# Altium schematic sheet Matrix.SchDoc
size C; SheetNumber: 2; SheetTotal: 2
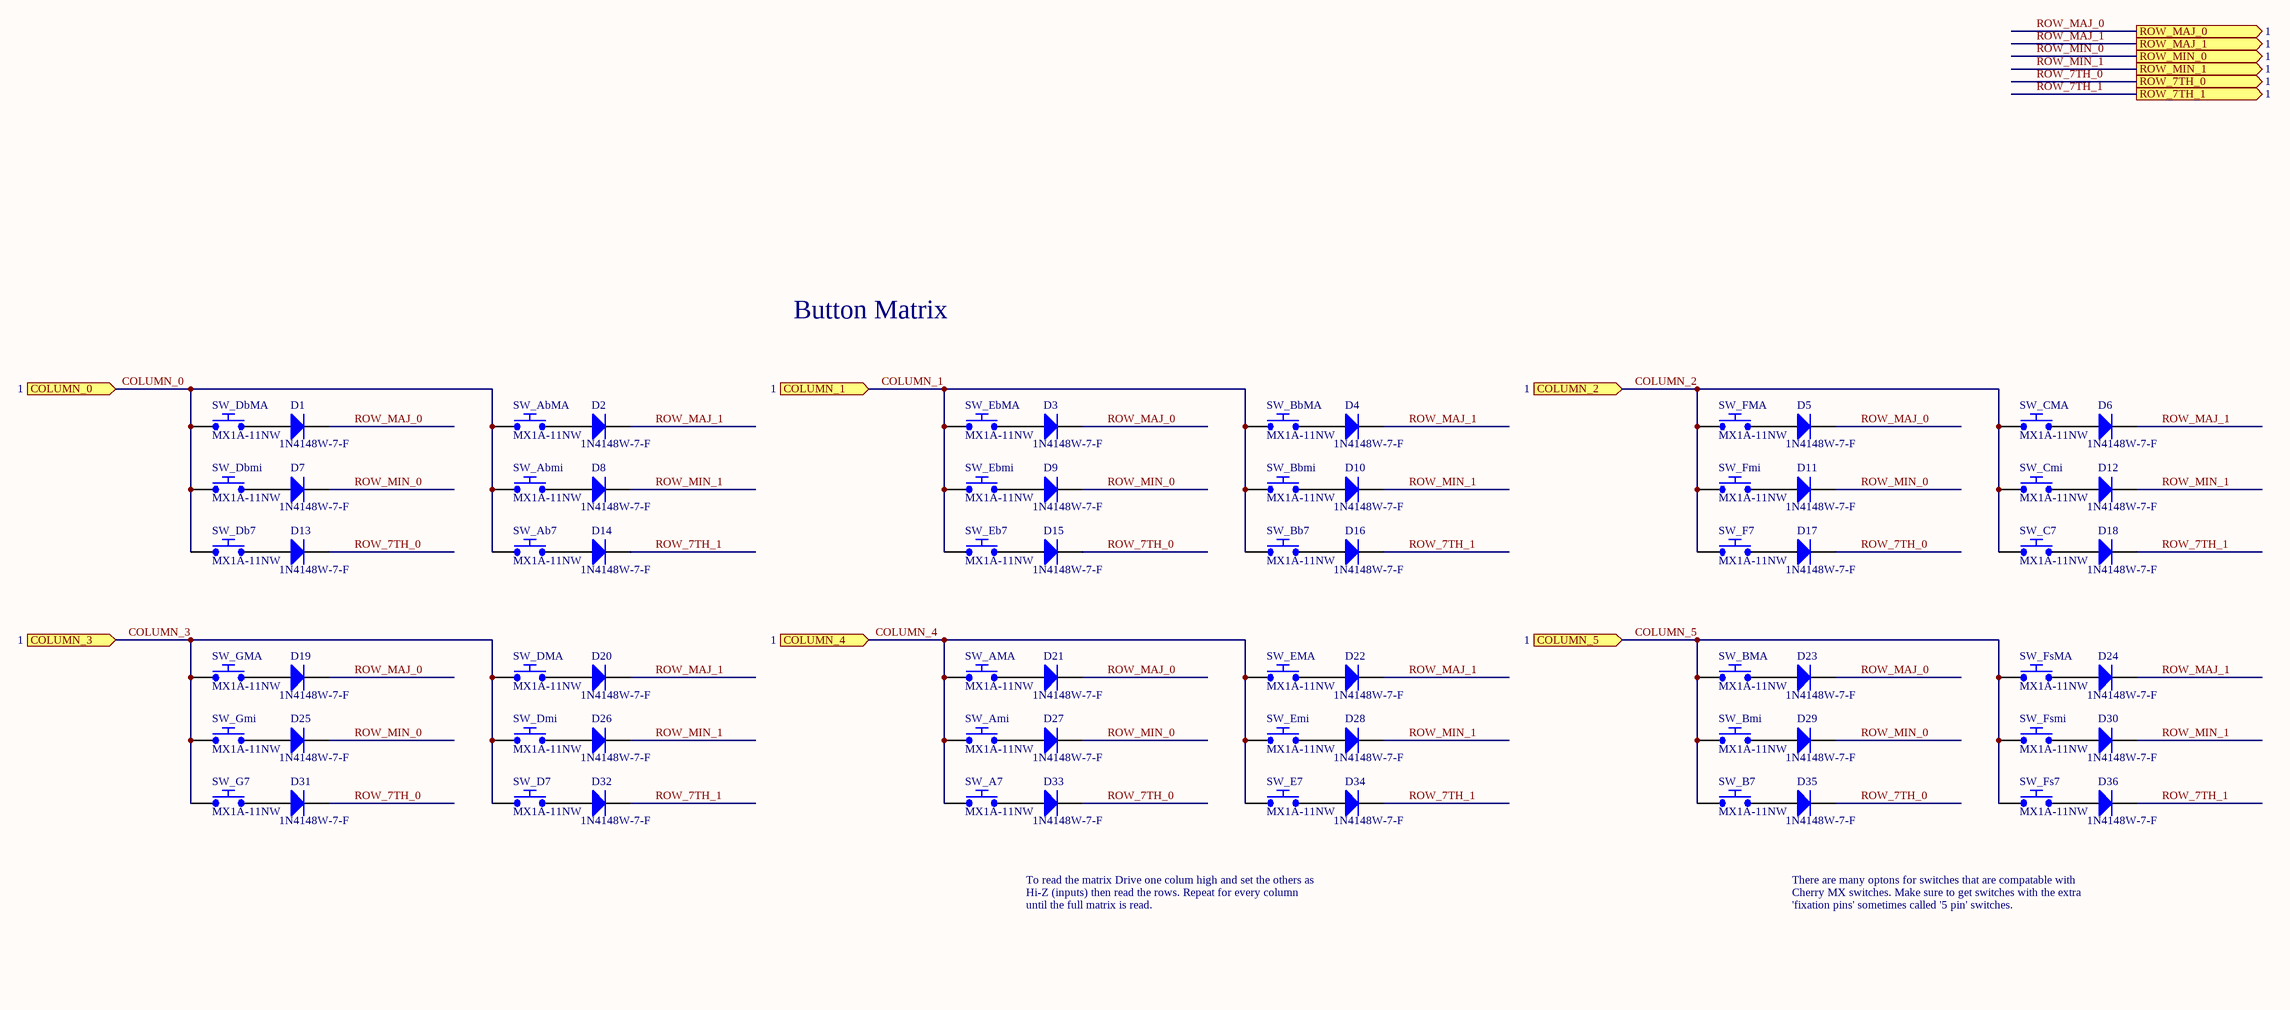
[diagram p0: Matrix.SchDoc]

## Parts
D1  1N4148W-7-F  [SOD-123]
D2  1N4148W-7-F  [SOD-123]
D3  1N4148W-7-F  [SOD-123]
D4  1N4148W-7-F  [SOD-123]
D5  1N4148W-7-F  [SOD-123]
D6  1N4148W-7-F  [SOD-123]
D7  1N4148W-7-F  [SOD-123]
D8  1N4148W-7-F  [SOD-123]
D9  1N4148W-7-F  [SOD-123]
D10  1N4148W-7-F  [SOD-123]
D11  1N4148W-7-F  [SOD-123]
D12  1N4148W-7-F  [SOD-123]
D13  1N4148W-7-F  [SOD-123]
D14  1N4148W-7-F  [SOD-123]
D15  1N4148W-7-F  [SOD-123]
D16  1N4148W-7-F  [SOD-123]
D17  1N4148W-7-F  [SOD-123]
D18  1N4148W-7-F  [SOD-123]
D19  1N4148W-7-F  [SOD-123]
D20  1N4148W-7-F  [SOD-123]
D21  1N4148W-7-F  [SOD-123]
D22  1N4148W-7-F  [SOD-123]
D23  1N4148W-7-F  [SOD-123]
D24  1N4148W-7-F  [SOD-123]
D25  1N4148W-7-F  [SOD-123]
D26  1N4148W-7-F  [SOD-123]
D27  1N4148W-7-F  [SOD-123]
D28  1N4148W-7-F  [SOD-123]
D29  1N4148W-7-F  [SOD-123]
D30  1N4148W-7-F  [SOD-123]
D31  1N4148W-7-F  [SOD-123]
D32  1N4148W-7-F  [SOD-123]
D33  1N4148W-7-F  [SOD-123]
D34  1N4148W-7-F  [SOD-123]
D35  1N4148W-7-F  [SOD-123]
D36  1N4148W-7-F  [SOD-123]
SW_A7  MX1A-11NW  [CHERRY_MX_FIX]
SW_Ab7  MX1A-11NW  [CHERRY_MX_FIX]
SW_AbMA  MX1A-11NW  [CHERRY_MX_FIX]
SW_Abmi  MX1A-11NW  [CHERRY_MX_FIX]
SW_AMA  MX1A-11NW  [CHERRY_MX_FIX]
SW_Ami  MX1A-11NW  [CHERRY_MX_FIX]
SW_B7  MX1A-11NW  [CHERRY_MX_FIX]
SW_Bb7  MX1A-11NW  [CHERRY_MX_FIX]
SW_BbMA  MX1A-11NW  [CHERRY_MX_FIX]
SW_Bbmi  MX1A-11NW  [CHERRY_MX_FIX]
SW_BMA  MX1A-11NW  [CHERRY_MX_FIX]
SW_Bmi  MX1A-11NW  [CHERRY_MX_FIX]
SW_C7  MX1A-11NW  [CHERRY_MX_FIX]
SW_CMA  MX1A-11NW  [CHERRY_MX_FIX]
SW_Cmi  MX1A-11NW  [CHERRY_MX_FIX]
SW_D7  MX1A-11NW  [CHERRY_MX_FIX]
SW_Db7  MX1A-11NW  [CHERRY_MX_FIX]
SW_DbMA  MX1A-11NW  [CHERRY_MX_FIX]
SW_Dbmi  MX1A-11NW  [CHERRY_MX_FIX]
SW_DMA  MX1A-11NW  [CHERRY_MX_FIX]
SW_Dmi  MX1A-11NW  [CHERRY_MX_FIX]
SW_E7  MX1A-11NW  [CHERRY_MX_FIX]
SW_Eb7  MX1A-11NW  [CHERRY_MX_FIX]
SW_EbMA  MX1A-11NW  [CHERRY_MX_FIX]
SW_Ebmi  MX1A-11NW  [CHERRY_MX_FIX]
SW_EMA  MX1A-11NW  [CHERRY_MX_FIX]
SW_Emi  MX1A-11NW  [CHERRY_MX_FIX]
SW_F7  MX1A-11NW  [CHERRY_MX_FIX]
SW_FMA  MX1A-11NW  [CHERRY_MX_FIX]
SW_Fmi  MX1A-11NW  [CHERRY_MX_FIX]
SW_Fs7  MX1A-11NW  [CHERRY_MX_FIX]
SW_FsMA  MX1A-11NW  [CHERRY_MX_FIX]
SW_Fsmi  MX1A-11NW  [CHERRY_MX_FIX]
SW_G7  MX1A-11NW  [CHERRY_MX_FIX]
SW_GMA  MX1A-11NW  [CHERRY_MX_FIX]
SW_Gmi  MX1A-11NW  [CHERRY_MX_FIX]

## Ports
COLUMN_0 (in, see 1), COLUMN_1 (in, see 1), COLUMN_2 (in, see 1), COLUMN_3 (in, see 1), COLUMN_4 (in, see 1), COLUMN_5 (in, see 1), ROW_7TH_0 (out, see 1), ROW_7TH_1 (out, see 1), ROW_MAJ_0 (out, see 1), ROW_MAJ_1 (out, see 1), ROW_MIN_0 (out, see 1), ROW_MIN_1 (out, see 1)

## Nets
COLUMN_0: SW_Ab7.1 SW_AbMA.1 SW_Abmi.1 SW_Db7.1 SW_DbMA.1 SW_Dbmi.1 ; port COLUMN_0
COLUMN_1: SW_Bb7.1 SW_BbMA.1 SW_Bbmi.1 SW_Eb7.1 SW_EbMA.1 SW_Ebmi.1 ; port COLUMN_1
COLUMN_2: SW_C7.1 SW_CMA.1 SW_Cmi.1 SW_F7.1 SW_FMA.1 SW_Fmi.1 ; port COLUMN_2
COLUMN_3: SW_D7.1 SW_DMA.1 SW_Dmi.1 SW_G7.1 SW_GMA.1 SW_Gmi.1 ; port COLUMN_3
COLUMN_4: SW_A7.1 SW_AMA.1 SW_Ami.1 SW_E7.1 SW_EMA.1 SW_Emi.1 ; port COLUMN_4
COLUMN_5: SW_B7.1 SW_BMA.1 SW_Bmi.1 SW_Fs7.1 SW_FsMA.1 SW_Fsmi.1 ; port COLUMN_5
ROW_7TH_0: D13.1(C) D15.1(C) D17.1(C) D31.1(C) D33.1(C) D35.1(C) ; port ROW_7TH_0
ROW_7TH_1: D14.1(C) D16.1(C) D18.1(C) D32.1(C) D34.1(C) D36.1(C) ; port ROW_7TH_1
ROW_MAJ_0: D1.1(C) D3.1(C) D5.1(C) D19.1(C) D21.1(C) D23.1(C) ; port ROW_MAJ_0
ROW_MAJ_1: D2.1(C) D4.1(C) D6.1(C) D20.1(C) D22.1(C) D24.1(C) ; port ROW_MAJ_1
ROW_MIN_0: D7.1(C) D9.1(C) D11.1(C) D25.1(C) D27.1(C) D29.1(C) ; port ROW_MIN_0
ROW_MIN_1: D8.1(C) D10.1(C) D12.1(C) D26.1(C) D28.1(C) D30.1(C) ; port ROW_MIN_1
NetD1_2: D1.2(A) SW_DbMA.2
NetD2_2: D2.2(A) SW_AbMA.2
NetD3_2: D3.2(A) SW_EbMA.2
NetD4_2: D4.2(A) SW_BbMA.2
NetD5_2: D5.2(A) SW_FMA.2
NetD6_2: D6.2(A) SW_CMA.2
NetD7_2: D7.2(A) SW_Dbmi.2
NetD8_2: D8.2(A) SW_Abmi.2
NetD9_2: D9.2(A) SW_Ebmi.2
NetD10_2: D10.2(A) SW_Bbmi.2
NetD11_2: D11.2(A) SW_Fmi.2
NetD12_2: D12.2(A) SW_Cmi.2
NetD13_2: D13.2(A) SW_Db7.2
NetD14_2: D14.2(A) SW_Ab7.2
NetD15_2: D15.2(A) SW_Eb7.2
NetD16_2: D16.2(A) SW_Bb7.2
NetD17_2: D17.2(A) SW_F7.2
NetD18_2: D18.2(A) SW_C7.2
NetD19_2: D19.2(A) SW_GMA.2
NetD20_2: D20.2(A) SW_DMA.2
NetD21_2: D21.2(A) SW_AMA.2
NetD22_2: D22.2(A) SW_EMA.2
NetD23_2: D23.2(A) SW_BMA.2
NetD24_2: D24.2(A) SW_FsMA.2
NetD25_2: D25.2(A) SW_Gmi.2
NetD26_2: D26.2(A) SW_Dmi.2
NetD27_2: D27.2(A) SW_Ami.2
NetD28_2: D28.2(A) SW_Emi.2
NetD29_2: D29.2(A) SW_Bmi.2
NetD30_2: D30.2(A) SW_Fsmi.2
NetD31_2: D31.2(A) SW_G7.2
NetD32_2: D32.2(A) SW_D7.2
NetD33_2: D33.2(A) SW_A7.2
NetD34_2: D34.2(A) SW_E7.2
NetD35_2: D35.2(A) SW_B7.2
NetD36_2: D36.2(A) SW_Fs7.2

## Notes on the sheet
- Button Matrix
- To read the matrix Drive one colum high and set the others as Hi-Z (inputs) then read the rows. Repeat for every column until the full matrix is read.
- There are many optons for switches that are compatable with Cherry MX switches. Make sure to get switches with the extra 'fixation pins' sometimes called '5 pin' switches.
- Title:
- This work is licensed under a Creative Commons Attribution 4.0 International License. Derivative works should remove all Sophistry branding and ‘é’ watermark.
- Date:
- Engineer:
- Revision:
- Codename:
- Time:
- Variant:
- Sheet
- of

## Library data of the parts
D1-D36 = 1N4148W-7-F: DIODE SWITCH 100V 0.15A SOD123; Manufacturer: Diodes Incorporated; Diode Type: Standard; Current - Average Rectified (Io): 150mA; Voltage - Forward (Vf) (Max) @ If: 1.25V @ 150mA; Speed: Small Signal =< 200mA (Io), Any Speed; Reverse Recovery Time (trr): 4ns; Current - Reverse Leakage @ Vr: 1µA @ 75V; Capacitance @ Vr, F: 2pF @ 0V, 1MHz; PartNumber: 1N4148W-7-F; Datasheets: http://www.diodes.com/datasheets/ds30086.pdf; Supplier 1: Digi-Key; Supplier Part Number 1: 1N4148W-FDICT-ND; Manufacturer Part Number: 1N4148W-7-F; Series: 0; Voltage - DC Reverse (Vr) (Max): 100V; Mounting Type: Surface Mount; Package / Case: SOD-123; Supplier Device Package: SOD-123; Operating Temperature - Junction: -65°C ~ 150°C
SW_A7 SW_Ab7 SW_AbMA SW_Abmi SW_AMA SW_Ami SW_B7 SW_Bb7 SW_BbMA SW_Bbmi SW_BMA SW_Bmi SW_C7 SW_CMA SW_Cmi SW_D7 SW_Db7 SW_DbMA SW_Dbmi SW_DMA SW_Dmi SW_E7 SW_Eb7 SW_EbMA SW_Ebmi SW_EMA SW_Emi SW_F7 SW_FMA SW_Fmi SW_Fs7 SW_FsMA SW_Fsmi SW_G7 SW_GMA SW_Gmi = MX1A-11NW: SWITCH PUSH SPST-NO 0.01A 12V; Manufacturer: Cherry Americas LLC; HelpURL: https://media.digikey.com/pdf/Data%20Sheets/Cherry%20PDFs/MX%20Series.pdf; Supplier 1: Digi-Key; Supplier Part Number 1: CH160-ND; Supplier 2: Mouser; Supplier Part Number 2: 540-MX1A-11NW; PartNumber: MX1A-11NW; Manufacturer Part Number: MX1A-11NW